# Altium schematic sheet СhassisPartSCH.SchDoc
size A3; SheetNumber: 2; SheetTotal: 3
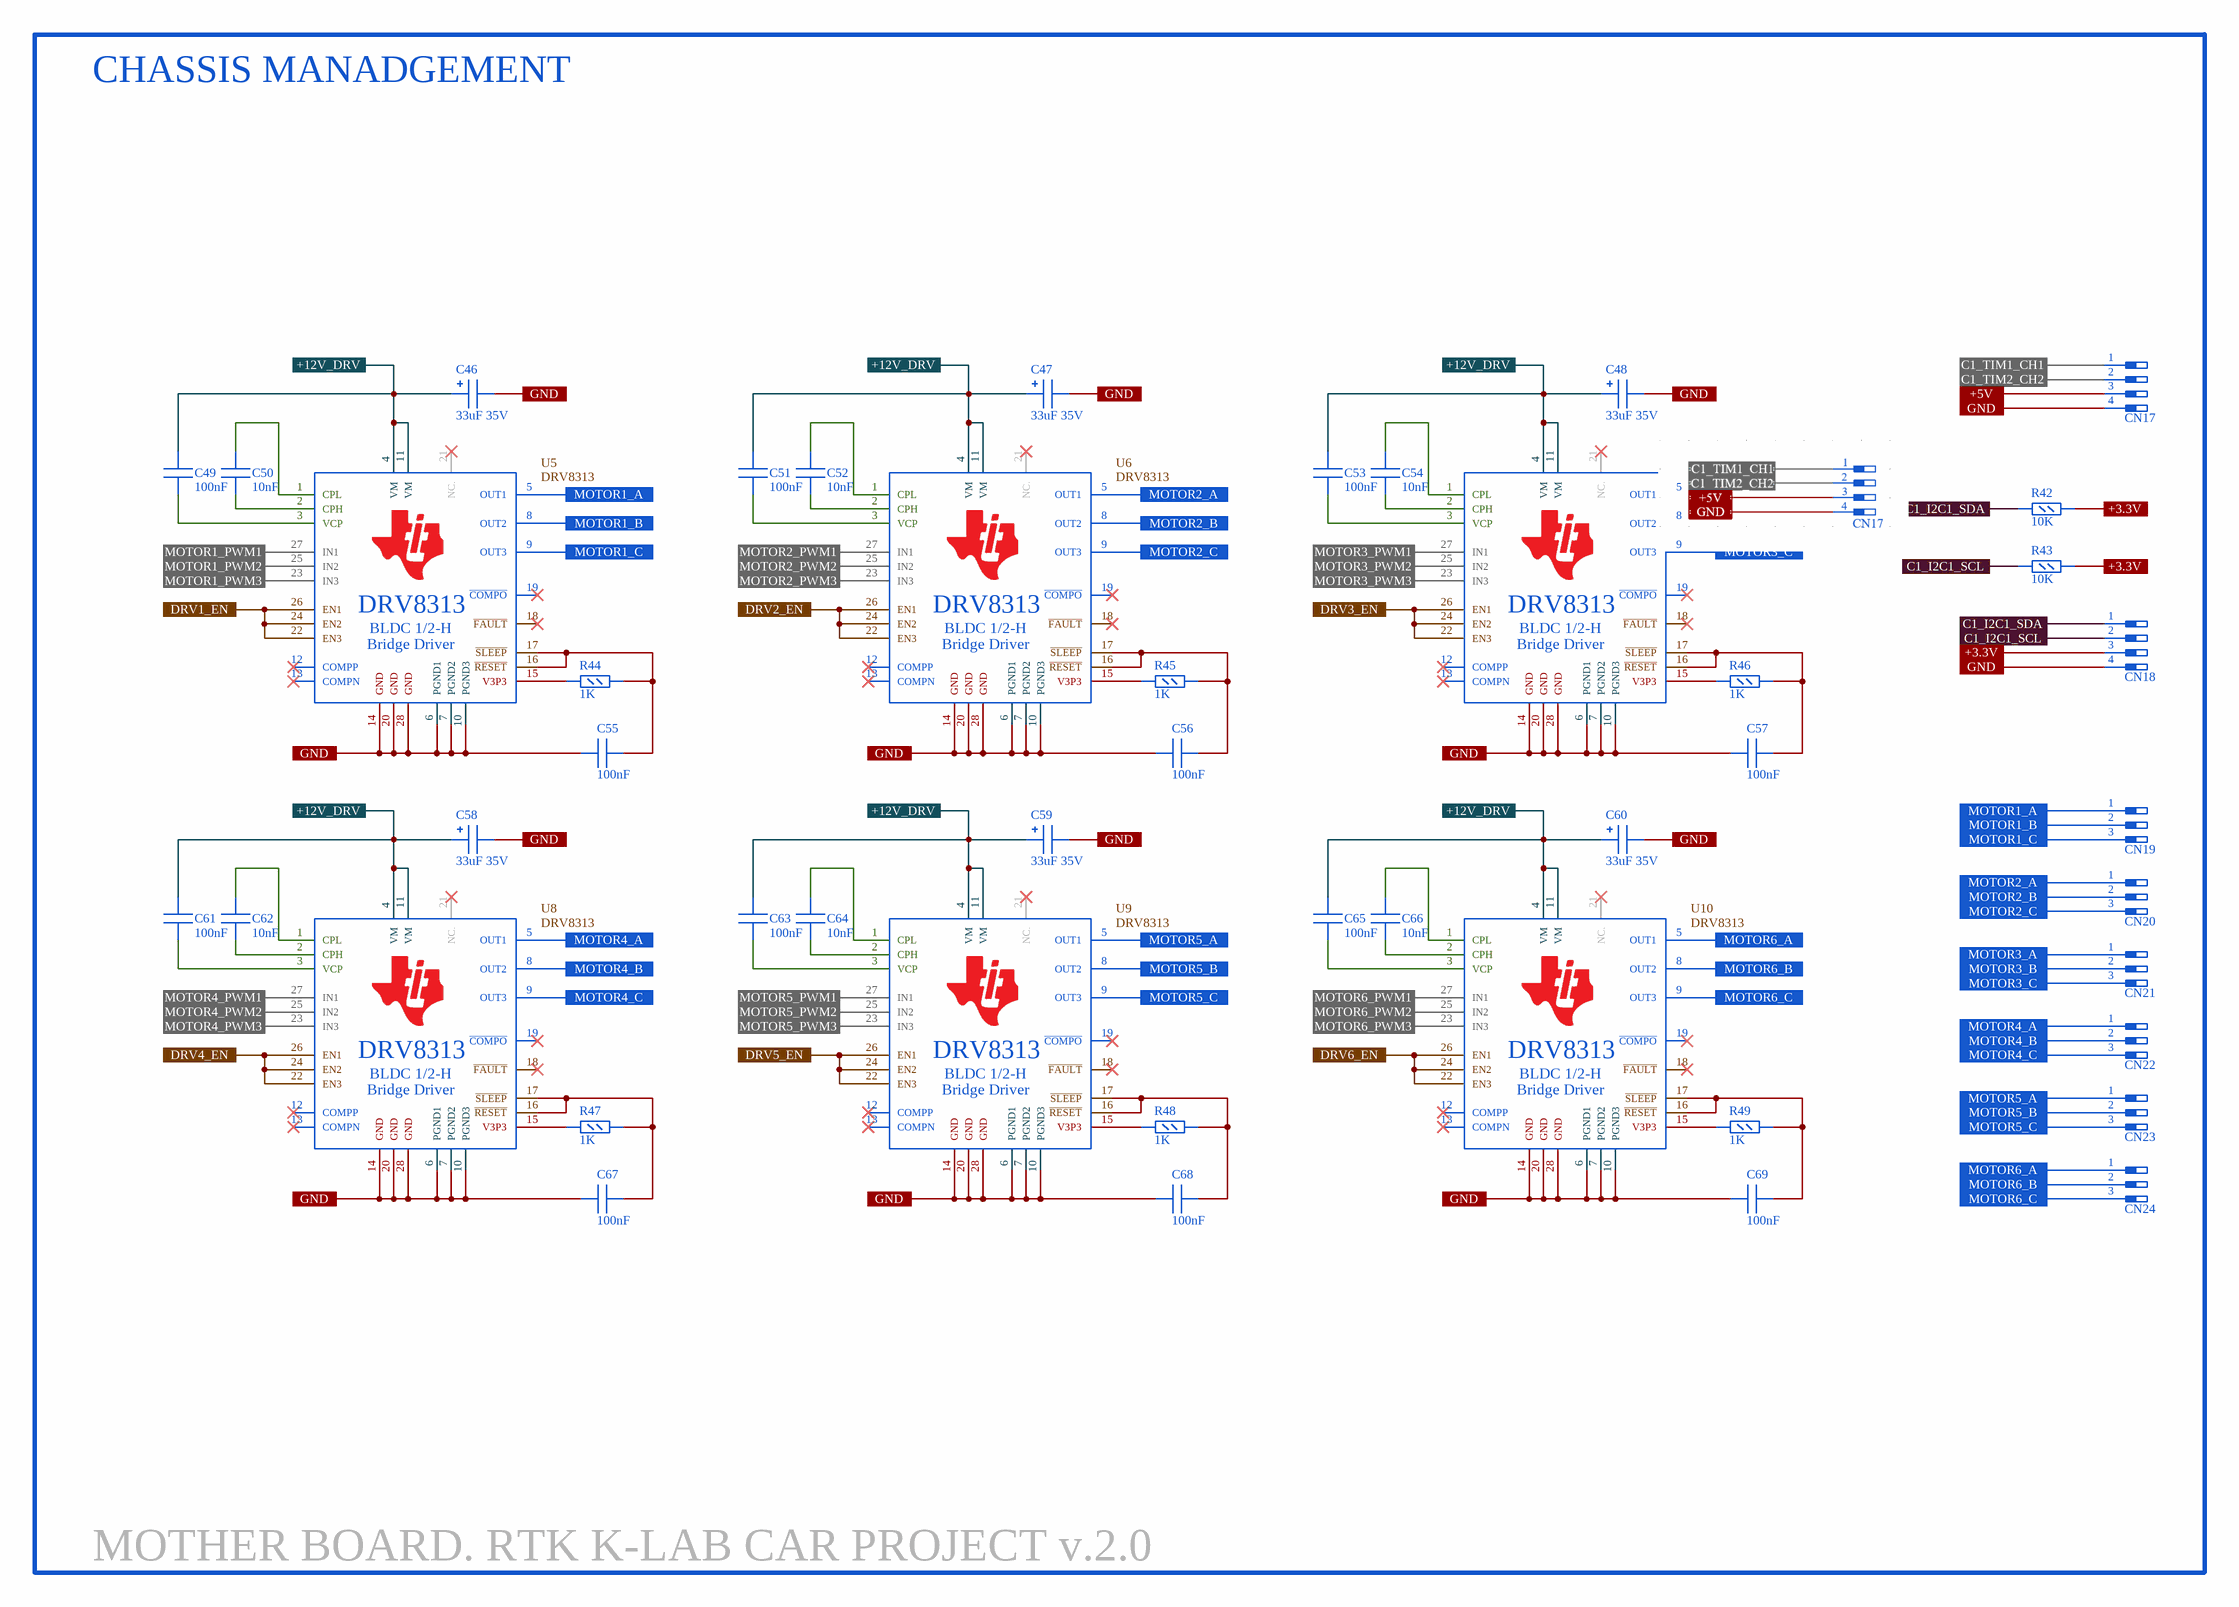
[diagram p0: СhassisPartSCH.SchDoc]

## Parts
C46  33uF 35V  [CAP_TAN-B]
C47  33uF 35V  [CAP_TAN-B]
C48  33uF 35V  [CAP_TAN-B]
C49  100nF  [C0603]
C50  10nF  [C0603]
C51  100nF  [C0603]
C52  10nF  [C0603]
C53  100nF  [C0603]
C54  10nF  [C0603]
C55  100nF  [C0603]
C56  100nF  [C0603]
C57  100nF  [C0603]
C58  33uF 35V  [CAP_TAN-B]
C59  33uF 35V  [CAP_TAN-B]
C60  33uF 35V  [CAP_TAN-B]
C61  100nF  [C0603]
C62  10nF  [C0603]
C63  100nF  [C0603]
C64  10nF  [C0603]
C65  100nF  [C0603]
C66  10nF  [C0603]
C67  100nF  [C0603]
C68  100nF  [C0603]
C69  100nF  [C0603]
CN17  1x04  [4X1F]  (value not drawn)
CN18  1x04  [XH2.54-4PIN]  (value not drawn)
CN19  1x03  [H3-5.08]  (value not drawn)
CN20  1x03  [H3-5.08]  (value not drawn)
CN21  1x03  [H3-5.08]  (value not drawn)
CN22  1x03  [H3-5.08]  (value not drawn)
CN23  1x03  [H3-5.08]  (value not drawn)
CN24  1x03  [H3-5.08]  (value not drawn)
R42  10K  [R0603]
R43  10K  [R0603]
R44  1K  [R0603]
R45  1K  [R0603]
R46  1K  [R0603]
R47  1K  [R0603]
R48  1K  [R0603]
R49  1K  [R0603]
U5  DRV8313  [TSSOP28-TP]
U6  DRV8313  [TSSOP28-TP]
U7  DRV8313  [TSSOP28-TP]
U8  DRV8313  [TSSOP28-TP]
U9  DRV8313  [TSSOP28-TP]
U10  DRV8313  [TSSOP28-TP]

## Ports
+3.3V, +5V, +12V_DRV, C1_I2C1_SCL, C1_I2C1_SDA, C1_TIM1_CH1, C1_TIM2_CH2, DRV1_EN, DRV2_EN, DRV3_EN, DRV4_EN, DRV5_EN, DRV6_EN, GND, MOTOR1_A, MOTOR1_B, MOTOR1_C, MOTOR1_PWM1, MOTOR1_PWM2, MOTOR1_PWM3, MOTOR2_A, MOTOR2_B, MOTOR2_C, MOTOR2_PWM1, MOTOR2_PWM2, MOTOR2_PWM3, MOTOR3_A, MOTOR3_B, MOTOR3_C, MOTOR3_PWM1, MOTOR3_PWM2, MOTOR3_PWM3, MOTOR4_A, MOTOR4_B, MOTOR4_C, MOTOR4_PWM1, MOTOR4_PWM2, MOTOR4_PWM3, MOTOR5_A, MOTOR5_B, MOTOR5_C, MOTOR5_PWM1, MOTOR5_PWM2, MOTOR5_PWM3, MOTOR6_A, MOTOR6_B, MOTOR6_C, MOTOR6_PWM1, MOTOR6_PWM2, MOTOR6_PWM3

## Nets
+3.3V: CN18.3 R42.2 R43.2 ; port +3.3V
+5V: CN17.3 ; port +5V
+12V_DRV: C46.1 C47.1 C48.1 C49.2 C51.2 C53.2 C58.1 C59.1 C60.1 C61.2 C63.2 C65.2 U5.4(VM) U5.11(VM) U6.4(VM) U6.11(VM) U7.4(VM) U7.11(VM) U8.4(VM) U8.11(VM) U9.4(VM) U9.11(VM) U10.4(VM) U10.11(VM) ; port +12V_DRV
C1_I2C1_SCL: CN18.2 R43.1 ; port C1_I2C1_SCL
C1_I2C1_SDA: CN18.1 R42.1 ; port C1_I2C1_SDA
C1_TIM1_CH1: CN17.1 ; port C1_TIM1_CH1
C1_TIM2_CH2: CN17.2 ; port C1_TIM2_CH2
DRV1_EN: U5.22(EN3) U5.24(EN2) U5.26(EN1) ; port DRV1_EN
DRV2_EN: U6.22(EN3) U6.24(EN2) U6.26(EN1) ; port DRV2_EN
DRV3_EN: U7.22(EN3) U7.24(EN2) U7.26(EN1) ; port DRV3_EN
DRV4_EN: U8.22(EN3) U8.24(EN2) U8.26(EN1) ; port DRV4_EN
DRV5_EN: U9.22(EN3) U9.24(EN2) U9.26(EN1) ; port DRV5_EN
DRV6_EN: U10.22(EN3) U10.24(EN2) U10.26(EN1) ; port DRV6_EN
GND: C46.2 C47.2 C48.2 C55.1 C56.1 C57.1 C58.2 C59.2 C60.2 C67.1 C68.1 C69.1 CN17.4 CN18.4 U5.6(PGND1) U5.7(PGND2) U5.10(PGND3) U5.14(GND) U5.20(GND) U5.28(GND) U6.6(PGND1) U6.7(PGND2) U6.10(PGND3) U6.14(GND) U6.20(GND) U6.28(GND) U7.6(PGND1) U7.7(PGND2) U7.10(PGND3) U7.14(GND) U7.20(GND) U7.28(GND) U8.6(PGND1) U8.7(PGND2) U8.10(PGND3) U8.14(GND) U8.20(GND) U8.28(GND) U9.6(PGND1) U9.7(PGND2) U9.10(PGND3) U9.14(GND) U9.20(GND) U9.28(GND) U10.6(PGND1) U10.7(PGND2) U10.10(PGND3) U10.14(GND) U10.20(GND) U10.28(GND) ; port GND
MOTOR1_A: CN19.1 U5.5(OUT1) ; port MOTOR1_A
MOTOR1_B: CN19.2 U5.8(OUT2) ; port MOTOR1_B
MOTOR1_C: CN19.3 U5.9(OUT3) ; port MOTOR1_C
MOTOR1_PWM1: U5.27(IN1) ; port MOTOR1_PWM1
MOTOR1_PWM2: U5.25(IN2) ; port MOTOR1_PWM2
MOTOR1_PWM3: U5.23(IN3) ; port MOTOR1_PWM3
MOTOR2_A: CN20.1 U6.5(OUT1) ; port MOTOR2_A
MOTOR2_B: CN20.2 U6.8(OUT2) ; port MOTOR2_B
MOTOR2_C: CN20.3 U6.9(OUT3) ; port MOTOR2_C
MOTOR2_PWM1: U6.27(IN1) ; port MOTOR2_PWM1
MOTOR2_PWM2: U6.25(IN2) ; port MOTOR2_PWM2
MOTOR2_PWM3: U6.23(IN3) ; port MOTOR2_PWM3
MOTOR3_A: CN21.1 U7.5(OUT1) ; port MOTOR3_A
MOTOR3_B: CN21.2 U7.8(OUT2) ; port MOTOR3_B
MOTOR3_C: CN21.3 U7.9(OUT3) ; port MOTOR3_C
MOTOR3_PWM1: U7.27(IN1) ; port MOTOR3_PWM1
MOTOR3_PWM2: U7.25(IN2) ; port MOTOR3_PWM2
MOTOR3_PWM3: U7.23(IN3) ; port MOTOR3_PWM3
MOTOR4_A: CN22.1 U8.5(OUT1) ; port MOTOR4_A
MOTOR4_B: CN22.2 U8.8(OUT2) ; port MOTOR4_B
MOTOR4_C: CN22.3 U8.9(OUT3) ; port MOTOR4_C
MOTOR4_PWM1: U8.27(IN1) ; port MOTOR4_PWM1
MOTOR4_PWM2: U8.25(IN2) ; port MOTOR4_PWM2
MOTOR4_PWM3: U8.23(IN3) ; port MOTOR4_PWM3
MOTOR5_A: CN23.1 U9.5(OUT1) ; port MOTOR5_A
MOTOR5_B: CN23.2 U9.8(OUT2) ; port MOTOR5_B
MOTOR5_C: CN23.3 U9.9(OUT3) ; port MOTOR5_C
MOTOR5_PWM1: U9.27(IN1) ; port MOTOR5_PWM1
MOTOR5_PWM2: U9.25(IN2) ; port MOTOR5_PWM2
MOTOR5_PWM3: U9.23(IN3) ; port MOTOR5_PWM3
MOTOR6_A: CN24.1 U10.5(OUT1) ; port MOTOR6_A
MOTOR6_B: CN24.2 U10.8(OUT2) ; port MOTOR6_B
MOTOR6_C: CN24.3 U10.9(OUT3) ; port MOTOR6_C
MOTOR6_PWM1: U10.27(IN1) ; port MOTOR6_PWM1
MOTOR6_PWM2: U10.25(IN2) ; port MOTOR6_PWM2
MOTOR6_PWM3: U10.23(IN3) ; port MOTOR6_PWM3
NetC49_1: C49.1 U5.3(VCP)
NetC50_1: C50.1 U5.2(CPH)
NetC50_2: C50.2 U5.1(CPL)
NetC51_1: C51.1 U6.3(VCP)
NetC52_1: C52.1 U6.2(CPH)
NetC52_2: C52.2 U6.1(CPL)
NetC53_1: C53.1 U7.3(VCP)
NetC54_1: C54.1 U7.2(CPH)
NetC54_2: C54.2 U7.1(CPL)
NetC55_2: C55.2 R44.2 U5.16(~{RESET}) U5.17(~{SLEEP})
NetC56_2: C56.2 R45.2 U6.16(~{RESET}) U6.17(~{SLEEP})
NetC57_2: C57.2 R46.2 U7.16(~{RESET}) U7.17(~{SLEEP})
NetC61_1: C61.1 U8.3(VCP)
NetC62_1: C62.1 U8.2(CPH)
NetC62_2: C62.2 U8.1(CPL)
NetC63_1: C63.1 U9.3(VCP)
NetC64_1: C64.1 U9.2(CPH)
NetC64_2: C64.2 U9.1(CPL)
NetC65_1: C65.1 U10.3(VCP)
NetC66_1: C66.1 U10.2(CPH)
NetC66_2: C66.2 U10.1(CPL)
NetC67_2: C67.2 R47.2 U8.16(~{RESET}) U8.17(~{SLEEP})
NetC68_2: C68.2 R48.2 U9.16(~{RESET}) U9.17(~{SLEEP})
NetC69_2: C69.2 R49.2 U10.16(~{RESET}) U10.17(~{SLEEP})
NetR44_1: R44.1 U5.15(V3P3)
NetR45_1: R45.1 U6.15(V3P3)
NetR46_1: R46.1 U7.15(V3P3)
NetR47_1: R47.1 U8.15(V3P3)
NetR48_1: R48.1 U9.15(V3P3)
NetR49_1: R49.1 U10.15(V3P3)

Not connected (* = marked no-connect by the designer): U5 12(COMPP)* 13(COMPN)* 18(~{FAULT})* 19(~{COMPO})* 21(NC.)*; U6 12(COMPP)* 13(COMPN)* 18(~{FAULT})* 19(~{COMPO})* 21(NC.)*; U7 12(COMPP)* 13(COMPN)* 18(~{FAULT})* 19(~{COMPO})* 21(NC.)*; U8 12(COMPP)* 13(COMPN)* 18(~{FAULT})* 19(~{COMPO})* 21(NC.)*; U9 12(COMPP)* 13(COMPN)* 18(~{FAULT})* 19(~{COMPO})* 21(NC.)*; U10 12(COMPP)* 13(COMPN)* 18(~{FAULT})* 19(~{COMPO})* 21(NC.)*

## Notes on the sheet
- CHASSIS MANADGEMENT
- MOTHER BOARD. RTK K-LAB CAR PROJECT v.2.0
- (in symbol DRV8313) BLDC 1/2-H; Bridge Driver

## Library data of the parts
C46-C48 C58-C60 = Cap_Pol: Value: 33uF 35V
C49-C57 C61-C69 = Cap
  C49 C51 C53 C55-C57 C61 C63 C65 C67-C69: Value: 100nF
  C50 C52 C54 C62 C64 C66: Value: 10nF
R42-R49 = Res
  R42 R43: Value: 10K
  R44-R49: Value: 1K
U5-U10 = DRV8313: Name: DRV8313